# EAGLE design expansion_module_BT_RN42 (EAGLE 9.2.1)
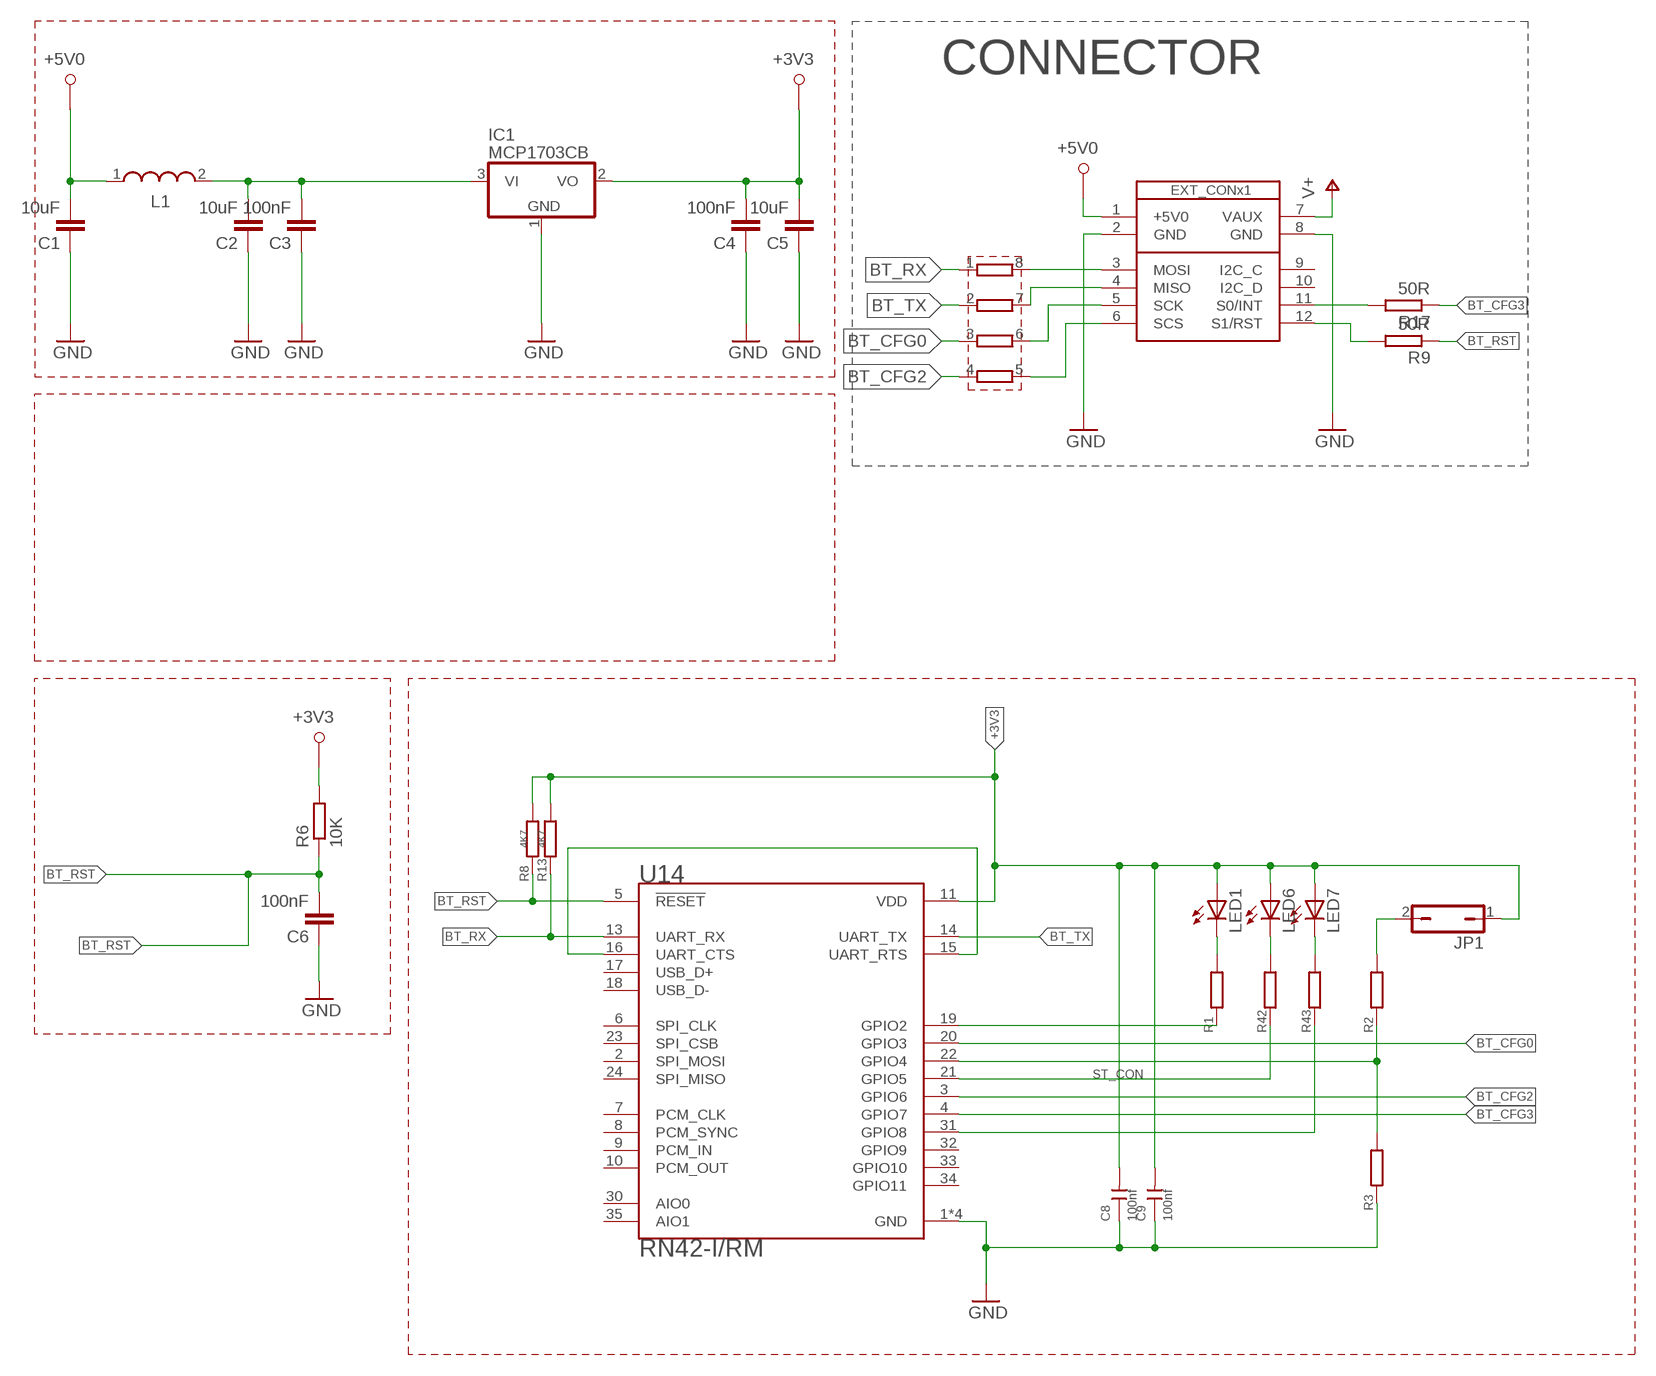
[diagram p0: schematic, sheet 1]

## Parts
C1  10uF  C-EUC0603  [C0603]
C2  10uF  C-EUC0603  [C0603]
C3  100nF  C-EUC0603  [C0603]
C4  100nF  C-EUC0603  [C0603]
C5  10uF  C-EUC0603  [C0603]
C6  100nF  C-EUC0402  [C0402]
C8  100nf  CERAMIC-100NF-25V-10%-X7R(0402)  [C0402]
C9  100nf  CERAMIC-100NF-25V-10%-X7R(0402)  [C0402]
IC1  MCP1703CB  [SOT23]
JP1  JP1Q  [JP1]
L1  WE-LQ_1210  [WE-LQ_M]
LED1  LEDSML0603  [SML0603]
LED6  LEDSML0603  [SML0603]
LED7  LEDSML0603  [SML0603]
R1  RESISTOR_0402  [RESISITOR_0402]
R2  RESISTOR_0402  [RESISITOR_0402]
R3  RESISTOR_0402  [RESISITOR_0402]
R6  10K  RESISTOR_0402  [RESISITOR_0402]
R8  4K7  RESISTOR_0402  [RESISITOR_0402]
R9  50R  RESISTOR_0402  [RESISITOR_0402]
R13  4K7  RESISTOR_0402  [RESISITOR_0402]
R17  50R  RESISTOR_0402  [RESISITOR_0402]
R42  RESISTOR_0402  [RESISITOR_0402]
R43  RESISTOR_0402  [RESISITOR_0402]
RN3  RESISTOR-DIL_4R-N  [EXB28V]
U14  RN42-I/RM  [XCVR_RN42-I/RM]
U$11  SB_EXT_CON_X1_SPI  [SB_EXT_CON_X1_FULL]

## Nets
+3V3: C4.2 C5.2 C8.2 C9.2 IC1.2(VO) JP1.1 LED1.A LED6.A LED7.A R6.2 R8.2 R13.2 U14.11(VDD)
+5V0: C1.2 L1.1 U$11.1(+5V0)
BT_CFG0: RN3.3 U14.20(GPIO3)
BT_CFG2: RN3.4 U14.3(GPIO6)
BT_CFG3: R17.1 U14.4(GPIO7)
BT_CTS: U14.15(UART_RTS) U14.16(UART_CTS)
BT_RST: C6.2 R6.1 R8.1 R9.1 U14.5(!RESET)
BT_RX: R13.1 RN3.1 U14.13(UART_RX)
BT_TX: RN3.2 U14.14(UART_TX)
GND: C1.1 C2.1 C3.1 C4.1 C5.1 C6.1 C8.1 C9.1 IC1.1(GND) R3.1 U14.1(GND) U14.12(GND) U14.28(GND) U14.29(GND) U$11.2(GND) U$11.8(GND)
N$1: C2.2 C3.2 IC1.3(VI) L1.2
N$6: R9.2 U$11.12(S1/RST)
N$7: R17.2 U$11.11(S0/INT)
N$8: LED1.C R1.2
N$12: R1.1 U14.19(GPIO2)
N$13: R2.1 R3.2 U14.22(GPIO4)
N$14: JP1.2 R2.2
N$15: LED6.C R42.2
N$16: RN3.8 U$11.3(MOSI)
N$19: LED7.C R43.2
N$21: RN3.7 U$11.4(MISO)
N$22: RN3.6 U$11.5(SCK)
N$23: RN3.5 U$11.6(SCS)
N$53: R43.1 U14.31(GPIO8)
ST_CON: R42.1 U14.21(GPIO5)
V+: U$11.7(VAUX)
Unconnected: U14.2(SPI_MOSI) U14.6(SPI_CLK) U14.7(PCM_CLK) U14.8(PCM_SYNC) U14.9(PCM_IN) U14.10(PCM_OUT) U14.17(USB_D+) U14.18(USB_D-) U14.23(SPI_CSB) U14.24(SPI_MISO) U14.30(AIO0) U14.32(GPIO9) U14.33(GPIO10) U14.34(GPIO11) U14.35(AIO1) U$11.9(I2C_C) U$11.10(I2C_D)

## Notes on the sheet
- CONNECTOR

## Library data of the parts
C1-C6 = resistor:C-EU: CAPACITOR, European symbol
C8 C9 = Seeed-Capacitor:CERAMIC-100NF-25V-10%-X7R(0402): 302010024; MPN: CC0402KRX7R8BB104
IC1 = linear:MCP1703: 250 mA, 16V, Low Quiescent Current LDO Regulator Source: http://ww1.microchip.com/downloads/en/DeviceDoc/22049b.pdf
JP1 = jumper:JP1Q: JUMPER
L1 = EagleLibrary_Wuerth_Elektronik_eiSos_rev16a:WE-LQ: SMD Inductor Characteristics Miniature chip inductor wound on a special ferrite core Small inductances for compact circuits High Q at high frequencies Low DC-resistance Operating temperature: –40 ºC to +125 ºC Applications Low power DC/DC-converters from Linear Technology, National Semiconductor, Texas Instruments, Fairchild Semiconductor, ON Semiconductor, STMicroelectronics, Maxim, MPS, Semtech, Exar, Analogic Tech, Diodes and Cologne Chip EMI-Filtering RF-circuits <http://katalog.we-online.de/media/images/eisos/IndLQ_pf2.jpg> Details see: http://katalog.we-online.de/en/pbs/WE-LQ? Updated by Dan Xu 2014-07-08 2014 (C) Wurth Elektronik
LED1 LED6 LED7 = led:LED: LED OSRAM: - CHIPLED LG R971, LG N971, LY N971, LG Q971, LY Q971, LO R971, LY R971 LH N974, LH R974 LS Q976, LO Q976, LY Q976 LO Q996 - Hyper CHIPLED LW Q18S LB Q993, LB Q99A, LB R99A - SideLED LS A670, LO A670, LY A670, LG A670, LP A670 LB A673, LV A673, LT A673, LW A673 LH A674 LY A675 LS A676, LA A676, LO A676, LY A676, LW A676 LS A679, LY A679, LG A679 - Hyper Micro SIDELED® LS Y876, LA Y876, LO Y876, LY Y876 LT Y87S - SmartLED LW L88C, LW L88S LB L89C, LB L89S, LG L890 LS L89K, LO L89K, LY L89K LS L896, LA L896, LO L896, LY L896 - TOPLED LS T670, LO T670, LY T670, LG T670, LP T670 LSG T670, LSP T670, LSY T670, LOP T670, LYG T670 LG T671, LOG T671, LSG T671 LB T673, LV T673, LT T673, LW T673 LH T674 LS T676, LA T676, LO T676, LY T676, LB T676, LH T676, LSB T676, LW T676 LB T67C, LV T67C, LT T67C, LS T67K, LO T67K, LY T67K, LW E67C LS E67B, LA E67B, LO E67B, LY E67B, LB E67C, LV E67C, LT E67C LW T67C LS T679, LY T679, LG T679 LS T770, LO T770, LY T770, LG T770, LP T770 LB T773, LV T773, LT T773, LW T773 LH T774 LS E675, LA E675, LY E675, LS T675 LS T776, LA T776, LO T776, LY T776, LB T776 LHGB T686 LT T68C, LB T68C - Hyper Mini TOPLED® LB M676 - Mini TOPLED Santana® LG M470 LS M47K, LO M47K, LY M47K Source: http://www.osram.convergy.de LUXEON: - LUMILED® LXK2-PW12-R00, LXK2-PW12-S00, LXK2-PW14-U00, LXK2-PW14-V00 LXK2-PM12-R00, LXK2-PM12-S00, LXK2-PM14-U00 LXK2-PE12-Q00, LXK2-PE12-R00, LXK2-PE12-S00, LXK2-PE14-T00, LXK2-PE14-U00 LXK2-PB12-K00, LXK2-PB12-L00, LXK2-PB12-M00, LXK2-PB14-N00, LXK2-PB14-P00, LXK2-PB14-Q00 LXK2-PR12-L00, LXK2-PR12-M00, LXK2-PR14-Q00, LXK2-PR14-R00 LXK2-PD12-Q00, LXK2-PD12-R00, LXK2-PD12-S00 LXK2-PH12-R00, LXK2-PH12-S00 LXK2-PL12-P00, LXK2-PL12-Q00, LXK2-PL12-R00 Source: www.luxeon.com KINGBRIGHT: KA-3528ASYC Source: www.kingbright.com
R1-R3 R6 R8 R9 R13 R17 R42 R43 = vb_RLC:RESISTOR_0402: 301010006
RN3 = vb_res_array:RESISTOR-DIL_4R-N: Array Chip Resistor Source: Panasonic
U14 = RN42-I_RM:RN42-I/RM: Bluetooth 2.1 class 2 surface mount module with built in antenna; AVAILABILITY: Unavailable; DESCRIPTION: Bluetooth Module; MF: Microchip; MP: RN42-I/RM; PACKAGE: SMD-35 Roving Networks; PRICE: None
U$11 = al_smartboard:SB_EXT_CON_X1_SPI

## Net classes
0 default: clearance 0.205 mm

## Board
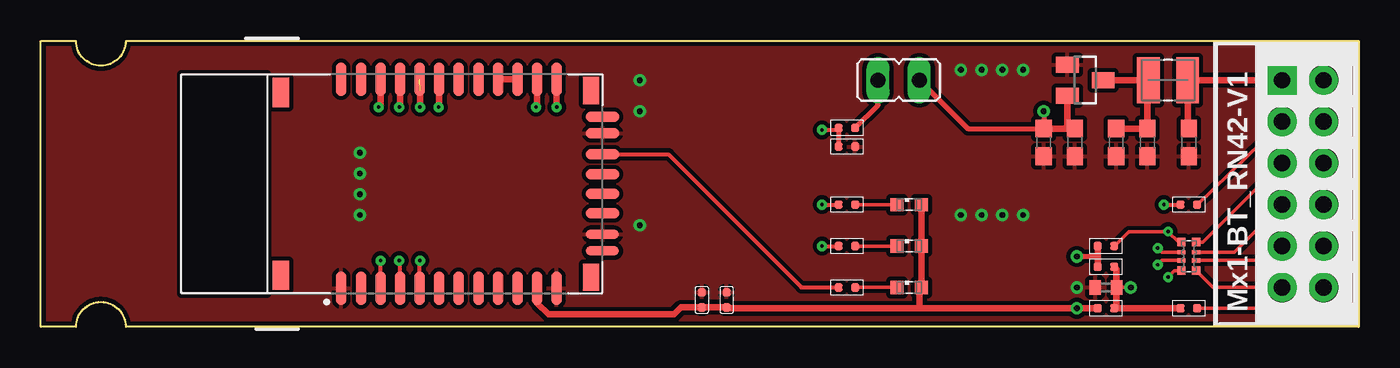
[diagram p1: board, top side]
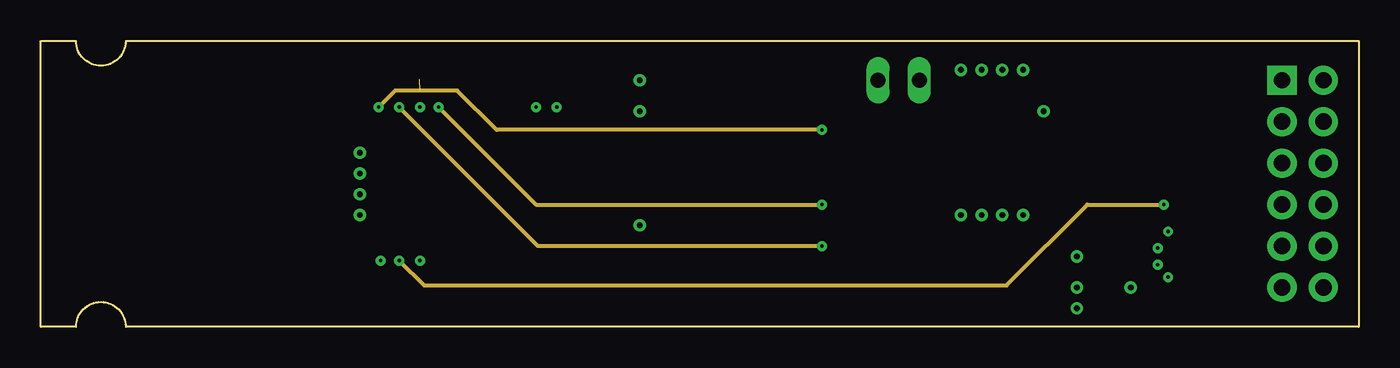
[diagram p2: board, inner layer Route2]
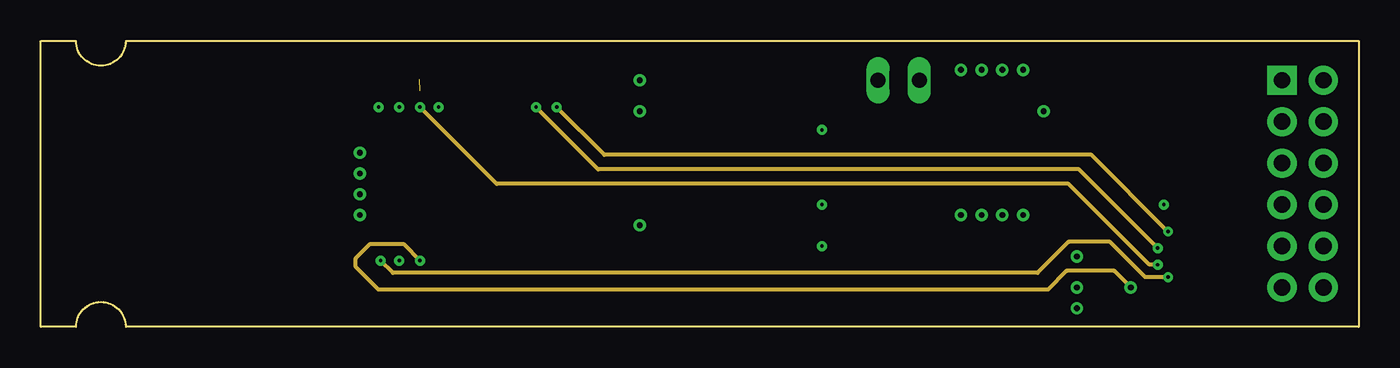
[diagram p3: board, inner layer Route15]
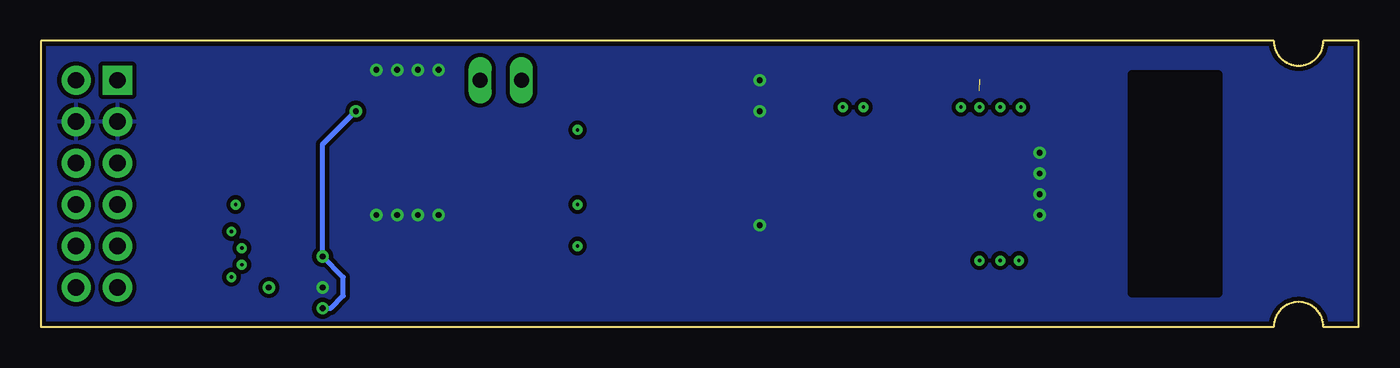
[diagram p4: board, bottom side, seen from below]

Size 80.77 x 17.53 mm. Coordinates in mm from the lower left corner, seen from the top.
Copper layers (1*2*15*16): Top 0.035mm / dielectric 1.5mm / Route2 0.035mm / dielectric 0.15mm / Route15 0.035mm / dielectric 0.2mm / Bottom 0.035mm
Design rules "default *": minimum track width 8mil, minimum drill 0.35mm, track to track 8mil, track to pad 8mil, pad to pad 8mil, via to via 8mil, smd to smd 6mil, copper to edge 5mil, drill to drill 8mil, minimum pad ring 10mil, minimum via ring 8mil, stop-mask expansion 4mil, vias tented up to drill 20mil, thermal gap 10mil

### Footprints (pad centres in the part's own frame; a part is rotated, then mirrored left to right if it is on the bottom)
C0603 = smd 1.1 x 1: 1 -0.85,0; 2 0.85,0
C0402 = smd 0.7 x 0.9: 1 -0.65,0; 2 0.65,0
C0402' = smd 0.5 x 0.5: 1 0,0.463; 2 0,-0.463
SOT23 = smd 1 x 1.4: 1 -0.95,-1.1; 2 0.95,-1.1; 3 0,1.1
JP1 = drill 0.914 long: 1 0,-1.27; 2 0,1.27
WE-LQ_M = smd 1.4 x 2.8: 1 -1.2,0; 2 1.2,0
SML0603 = smd 0.8 x 0.8: A 0.75,0; C -0.75,0
RESISITOR_0402 = smd 0.5 x 0.5: 1 0.508,0; 2 -0.508,0
EXB28V = smd 0.525 x 0.5: 1 -0.875,-0.45; 4 0.875,-0.45; 5 0.875,0.45; 8 -0.875,0.45 | smd 0.25 x 0.5: 2 -0.25,-0.45; 3 0.25,-0.45; 6 0.25,0.45; 7 -0.25,0.45
XCVR_RN42-I/RM = smd 2.032 x 0.635: 1 -6.4,6.6; 2 -6.4,5.4; 3 -6.4,4.2; 4 -6.4,3; 5 -6.4,1.8; 6 -6.4,0.6; 7 -6.4,-0.6; 8 -6.4,-1.8; 9 -6.4,-3; 10 -6.4,-4.2; 11 -6.4,-5.4; 12 -6.4,-6.6; 13 6.4,-6.6; 14 6.4,-5.4; 15 6.4,-4.2; 16 6.4,-3; 17 6.4,-1.8; 18 6.4,-0.6; 19 6.4,0.6; 20 6.4,1.8; 21 6.4,3; 22 6.4,4.2; 23 6.4,5.4; 24 6.4,6.6 | smd 0.635 x 2.032: 28 3.1,-9.4; 30 4.1,-9.4; 31 1.8,-9.4; 32 0.6,-9.4; 33 -0.6,-9.4; 34 -1.8,-9.4 | smd 0.584 x 2.032: 29 -3.1,-9.4; 35 -4.1,-9.4 | smd 1.673 x 1: S1 -5.727,-8.7; S2 5.727,-8.7 | smd 1.8 x 1: S3 5.6,10.3; S4 -5.6,10.3
SB_EXT_CON_X1_FULL = drill 1 pad 1.778 square: 1 15.24,5.08 | drill 1 pad 1.778: 2 12.7,5.08; 3 10.16,5.08; 4 7.62,5.08; 5 5.08,5.08; 6 2.54,5.08; 7 15.24,2.54; 8 12.7,2.54; 9 10.16,2.54; 10 7.62,2.54; 11 5.08,2.54; 12 2.54,2.54

### Placement (x,y rotation side)
C1  70.36,11.3 90 top
C2  67.82,11.3 90 top
C3  65.91,11.3 90 top
C4  63.37,11.3 90 top
C5  61.47,11.3 90 top
C6  65.28,2.41 0 top
C8  100nf  [C0402']  40.51,1.65 0 top
C9  100nf  [C0402']  42.04,1.65 0 top
IC1  64.01,15.11 270 top
JP1  52.58,15.11 90 top
L1  69.09,15.11 180 top
LED1  53.21,7.49 0 top
LED6  53.21,4.95 0 top
LED7  53.21,2.41 0 top
R1  49.4,7.49 180 top
R2  49.4,12.19 180 top
R3  49.4,11.05 0 top
R6  65.28,3.68 0 top
R8  65.28,1.14 0 top
R9  70.36,1.14 180 top
R13  65.28,4.95 0 top
R17  70.36,7.49 180 top
R42  49.4,4.95 180 top
R43  49.4,2.41 180 top
RN3  70.36,4.32 270 top
U14  25.02,8.76 90 top
U$11  81.15,-0.13 90 top

### Tracks (layer width: path | path; a pad name or v marks a point on that pad's centre or on a via)
+3V3  (via drill 0.35)
  Top 0.203: 53.96,15 JP1.1
  Top 0.305: v63.5,4.32 64.77,4.32 | JP1.1 56.81,12.15 61.34,12.15 | 61.34,12.15 61.59,12.15 | v61.47,13.21 61.47,12.28 61.34,12.15
  Top 0.406: C5.2 61.59,12.15 62.74,12.15 | 62.74,12.15 C4.2 | IC1.2 62.91,12.32 62.74,12.15 | R13.2 64.77,4.32 R6.2 | R8.2 v63.5,1.14 53.85,1.14 | LED1.A LED6.A LED7.A 53.85,2.3 53.85,1.14 | U14.11 30.42,1.46 31.12,0.76 38.82,0.76 39.24,1.19 C8.2 C9.2 42.08,1.14 53.85,1.14
  Bottom 0.305: v63.5,1.14 62.99,1.14 62.23,1.9 62.23,3.05 v63.5,4.32 63.5,11.18 v61.47,13.21
+5V0
  Top 0.406: C1.2 70.29,12.22 L1.1 U$11.1
BT_CFG0  (via drill 0.2)  (1 unrouted)
  Top 0.203: RN3.3 68.71,4.07 v68.45,3.81
  Top 0.406: v23.24,13.46 23.24,14.48
  Route15 0.254: v68.45,3.81 67.95,3.81 62.99,8.76 27.94,8.76 v23.24,13.46
BT_CFG2  (via drill 0.2)
  Top 0.203: RN3.4 69.48,3.44 v69.09,3.05
  Top 0.254: U14.3 20.82,4.05 v20.83,4.06
  Route15 0.254: v69.09,3.05 67.69,3.05 65.53,5.21 62.99,5.21 61.09,3.3 21.59,3.3 v20.83,4.06
BT_CFG3  (via drill 0.2)
  Top 0.254: U14.4 22.02,4.02 v21.97,4.06 | v68.83,7.49 R17.1
  Route2 0.254: v21.97,4.06 23.5,2.54 59.18,2.54 64.14,7.49 v68.83,7.49
BT_CTS
  Top 0.406: U14.16 U14.15
BT_RST  (via drill 0.2, 0.35)
  Top 0.203: 67.95,1.14 65.91,1.14 | 65.91,1.14 R8.1 | 65.91,2.4 C6.2 v66.8,2.41 | 65.91,2.4 65.91,1.14 | R6.1 65.85,3.62 65.91,3.56 65.91,2.4
  Top 0.254: U14.5 23.22,4.04 v23.24,4.06
  Top 0.406: R9.1 65.91,1.14 | R8.1 65.93,1.29 C6.2 65.93,3.54 65.85,3.62
  Route15 0.254: v66.8,2.41 65.79,3.43 62.87,3.43 61.72,2.29 20.7,2.29 19.3,3.68 19.3,4.19 20.19,5.08 22.23,5.08 v23.24,4.06
BT_RX  (via drill 0.2)
  Top 0.203: RN3.1 69.74,5.19 v69.09,5.84 66.67,5.84 R13.1
  Top 0.406: U14.13 v31.62,13.47 v31.62,13.46
  Route15 0.254: v69.09,5.84 64.39,10.54 34.54,10.54 v31.62,13.46
BT_TX  (via drill 0.2)
  Top 0.203: RN3.2 68.71,4.57 v68.45,4.83
  Top 0.406: U14.14 30.42,13.53 v30.35,13.46
  Route15 0.254: v68.45,4.83 63.63,9.65 34.16,9.65 v30.35,13.46
GND  (via drill 0.35)
  other vias: 63.5,2.41 19.56,10.67 19.56,9.4 19.56,8.13 19.56,6.86 36.7,6.22 36.7,13.21 36.7,15.11 60.2,15.75 58.93,15.75 57.66,15.75 56.39,15.75 56.39,6.86 57.66,6.86 58.93,6.86 60.2,6.86
  pour Bottom (isolate 0.254): -1.4,17.65 81.15,17.65 81.15,-0.13 -1.4,-0.13
  pour Top (isolate 0.254): -0.51,17.52 83.06,17.66 83.06,-0.12 -0.51,-0.26
N$1
  Top 0.406: IC1.3 L1.2 67.82,15.04 C2.2 C3.2
N$6
  Top 0.203: R9.2 77.34,1.14 U$11.12
N$7
  Top 0.203: R17.2 74.82,11.3 76.71,11.3 77.34,10.67 77.34,6.22 U$11.11
N$8
  Top 0.203: LED1.C R1.2
N$12  (via drill 0.2)
  Top 0.254: v47.88,7.49 R1.1
  Top 0.406: U14.19 24.42,13.5 v24.38,13.46
  Route2 0.254: v24.38,13.46 30.35,7.49 v47.88,7.49
N$13  (via drill 0.2)
  Top 0.254: v47.88,12.06 48.9,12.06
  Top 0.305: R2.1 48.9,12.06 R3.2
  Top 0.406: v20.7,13.46 20.82,13.58 U14.22
  Route2 0.254: v47.88,12.06 27.94,12.06 25.53,14.48 21.72,14.48 v20.7,13.46
N$14
  Top 0.305: R2.2 51.31,13.59 JP1.2
N$15
  Top 0.203: LED6.C R42.2
N$16
  Top 0.203: RN3.8 71.23,5.19 U$11.3
N$19
  Top 0.203: R43.2 LED7.C
N$21
  Top 0.203: RN3.7 73.15,4.57 U$11.4
N$22
  Top 0.203: RN3.6 75.19,4.07 U$11.5
N$23
  Top 0.203: RN3.5 71.84,2.41 U$11.6
N$53
  Top 0.254: U14.31 38.46,10.56 46.61,2.41 R43.1
ST_CON  (via drill 0.2)
  Top 0.254: v47.88,4.95 R42.1
  Top 0.406: v21.97,13.46 22.02,13.51 U14.21
  Route2 0.254: v47.88,4.95 30.48,4.95 v21.97,13.46

### Text on the board
tNames: Mx1-BT_RN42-V1